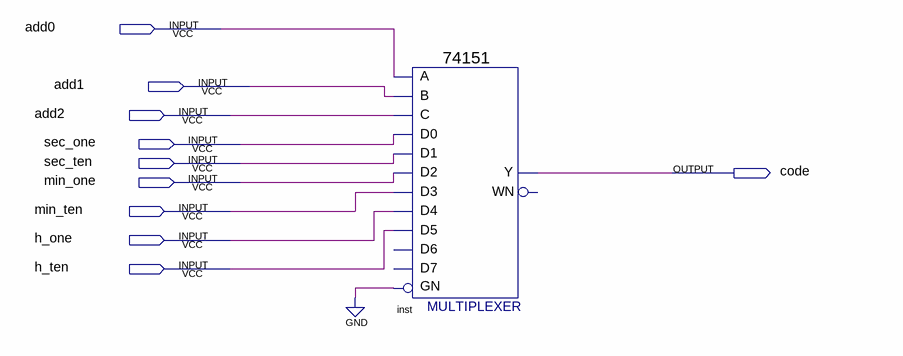
[diagram p0: schematic sheet]
// Quartus schematic select1bit.bdf as structural Verilog: 1 symbols, 10 pins
module select1bit (
  input  add0,
  input  add1,
  input  add2,
  input  sec_one,
  input  sec_ten,
  input  min_one,
  input  min_ten,
  input  h_one,
  input  h_ten,
  output code
);

  \74151  inst (
    .GN(1'b0), .C(add2), .B(add1), .A(add0), .D5(h_ten), .D0(sec_one), .D1(sec_ten), .D4(h_one),
    .D3(min_ten), .D2(min_one), .Y(code));  // open: D6, D7, WN
endmodule
